# Altium schematic sheet 09.SchDoc
size 594 x 420 mm
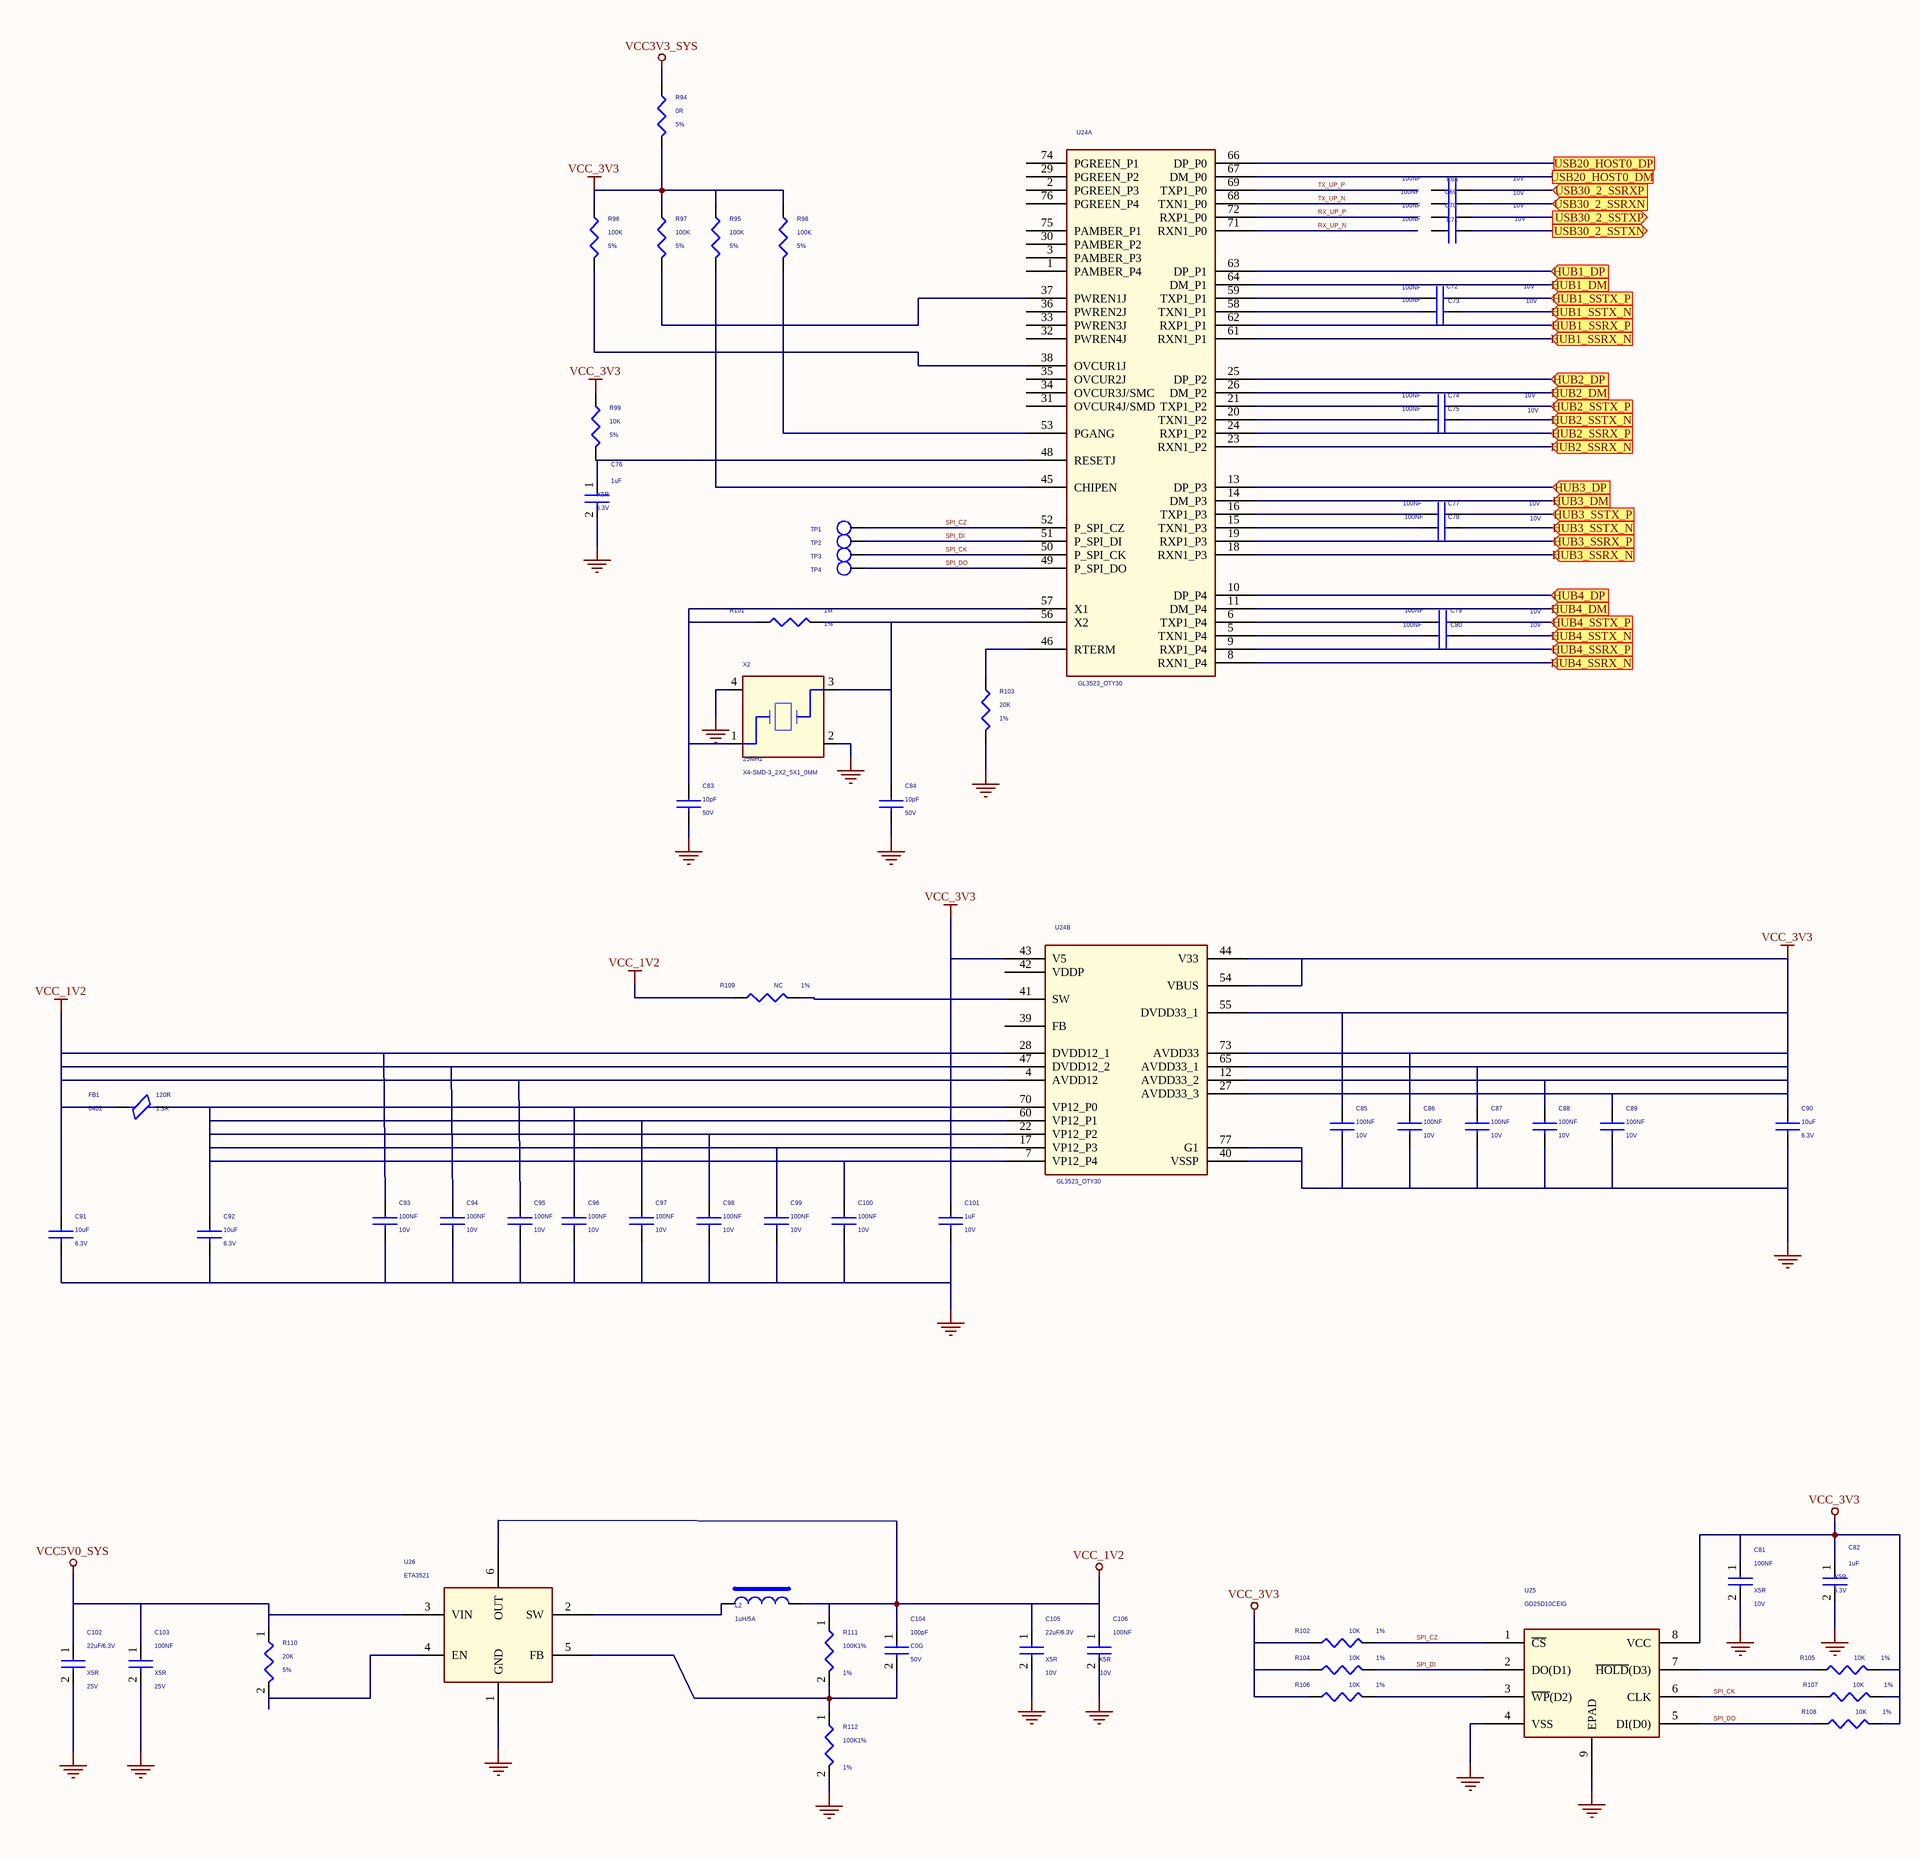
[diagram p0: 09.SchDoc]

## Parts
C68  100NF  Rating: 10V  [C0201]
C69  100NF  Rating: 10V  [C0201]
C70  100NF  Rating: 10V  [C0201]
C71  100NF  Rating: 10V  [C0201]
C72  100NF  Rating: 10V  [C0201]
C73  100NF  Rating: 10V  [C0201]
C74  100NF  Rating: 10V  [C0201]
C75  100NF  Rating: 10V  [C0201]
C76  1uF  Voltage: 6.3V  Dielectric: X5R  [C0201]
C77  100NF  Rating: 10V  [C0201]
C78  100NF  Rating: 10V  [C0201]
C79  100NF  Rating: 10V  [C0201]
C80  100NF  Rating: 10V  [C0201]
C81  100NF  Voltage: 10V  Dielectric: X5R  [C0201]
C82  1uF  Voltage: 6.3V  Dielectric: X5R  [C0201]
C83  10pF  Rating: 50V  [C0201]
C84  10pF  Rating: 50V  [C0201]
C85  100NF  Rating: 10V  [C0201]
C86  100NF  Rating: 10V  [C0201]
C87  100NF  Rating: 10V  [C0201]
C88  100NF  Rating: 10V  [C0201]
C89  100NF  Rating: 10V  [C0201]
C90  10uF  Rating: 6.3V  [C0402]
C91  10uF  Rating: 6.3V  [C0402]
C92  10uF  Rating: 6.3V  [C0402]
C93  100NF  Rating: 10V  [C0201]
C94  100NF  Rating: 10V  [C0201]
C95  100NF  Rating: 10V  [C0201]
C96  100NF  Rating: 10V  [C0201]
C97  100NF  Rating: 10V  [C0201]
C98  100NF  Rating: 10V  [C0201]
C99  100NF  Rating: 10V  [C0201]
C100  100NF  Rating: 10V  [C0201]
C101  1uF  Rating: 10V  [C0201]
C102  22uF/6.3V  Voltage: 25V  Dielectric: X5R  [C0805]
C103  100NF  Voltage: 25V  Dielectric: X5R  [C0402]
C104  100pF  Voltage: 50V  Dielectric: C0G  [C0402]
C105  22uF/6.3V  Voltage: 10V  Dielectric: X5R  [C0805]
C106  100NF  Voltage: 10V  Dielectric: X5R  [C0402]
FB1  120R  Rating: 1.3A  Package Size: 0402  [L0402]
L2  1uH/5A  [IND-303015]
R94  0R  Rating: 5%  [R0603]
R95  100K  Rating: 5%  [R0201]
R96  100K  Rating: 5%  [R0201]
R97  100K  Rating: 5%  [R0201]
R98  100K  Rating: 5%  [R0201]
R99  10K  Rating: 5%  [R0201]
R101  1M  Rating: 1%  [R0201]
R102  10K  Rating: 1%  [R0201]
R103  20K  Rating: 1%  [R0201]
R104  10K  Rating: 1%  [R0201]
R105  10K  Rating: 1%  [R0201]
R106  10K  Rating: 1%  [R0201]
R107  10K  Rating: 1%  [R0201]
R108  10K  Rating: 1%  [R0201]
R109  NC  Rating: 1%  [R0201]
R110  20K  Tolerance: 5%  [R0402]
R111  100K1%  Tolerance: 1%  [R0402]
R112  100K1%  Tolerance: 1%  [R0402]
TP1  TP  [tp1-8040]  (value not drawn)
TP2  TP  [tp1-8040]  (value not drawn)
TP3  TP  [tp1-8040]  (value not drawn)
TP4  TP  [tp1-8040]  (value not drawn)
U24  GL3523_OTY30  [GL3523_OTY30]  (parts A,B of 2)
U25  GD25D10CEIG  [USON8]
U26  ETA3521  [SOT563]
X2  25MHz  [X4-SMD-3_2X2_5X1_0MM]

## Ports
HUB1_DM (in), HUB1_DP (in), HUB1_SSRX_N (in), HUB1_SSRX_P (in), HUB1_SSTX_N (in), HUB1_SSTX_P (in), HUB2_DM (in), HUB2_DP (in), HUB2_SSRX_N (in), HUB2_SSRX_P (in), HUB2_SSTX_N (in), HUB2_SSTX_P (in), HUB3_DM (in), HUB3_DP (in), HUB3_SSRX_N (in), HUB3_SSRX_P (in), HUB3_SSTX_N (in), HUB3_SSTX_P (in), HUB4_DM (in), HUB4_DP (in), HUB4_SSRX_N (in), HUB4_SSRX_P (in), HUB4_SSTX_N (in), HUB4_SSTX_P (in), USB20_HOST0_DM, USB20_HOST0_DP, USB30_2_SSRXN (in), USB30_2_SSRXP (in), USB30_2_SSTXN (out), USB30_2_SSTXP (out)

## Nets
GND: C76.2 C81.2 C82.2 C83.2 C84.2 C85.2 C86.2 C87.2 C88.2 C89.2 C90.2 C91.2 C92.2 C93.2 C94.2 C95.2 C96.2 C97.2 C98.2 C99.2 C100.2 C101.2 C102.2 C103.2 C105.2 C106.2 R103.2 R112.2 U24.40(VSSP) U24.77(G1) U25.4(VSS) U25.9(EPAD) U26.1(GND) X2.2 X2.4
VCC3V3_SYS: R94.1
VCC5V0_SYS: C102.1 C103.1 R110.1 U26.3(VIN)
VCC_1V2: C91.1 C93.1 C94.1 C95.1 C104.1 C105.1 C106.1 FB1.1 L2.2 R109.1 R111.1 U24.4(AVDD12) U24.28(DVDD12_1) U24.47(DVDD12_2) U26.6(OUT)
VCC_3V3: C81.1 C82.1 C85.1 C86.1 C87.1 C88.1 C89.1 C90.1 C101.1 R94.2 R95.1 R96.1 R97.1 R98.1 R99.1 R102.1 R104.1 R105.2 R106.1 R107.2 R108.2 U24.12(AVDD33_2) U24.27(AVDD33_3) U24.43(V5) U24.44(V33) U24.54(VBUS) U24.55(DVDD33_1) U24.65(AVDD33_1) U24.73(AVDD33) U25.8(VCC)
HUB1_DM: U24.64(DM_P1) ; port HUB1_DM
HUB1_DP: U24.63(DP_P1) ; port HUB1_DP
HUB1_SSRX_N: U24.61(RXN1_P1) ; port HUB1_SSRX_N
HUB1_SSRX_P: U24.62(RXP1_P1) ; port HUB1_SSRX_P
HUB1_SSTX_N: C73.2 ; port HUB1_SSTX_N
HUB1_SSTX_P: C72.2 ; port HUB1_SSTX_P
HUB2_DM: U24.26(DM_P2) ; port HUB2_DM
HUB2_DP: U24.25(DP_P2) ; port HUB2_DP
HUB2_SSRX_N: U24.23(RXN1_P2) ; port HUB2_SSRX_N
HUB2_SSRX_P: U24.24(RXP1_P2) ; port HUB2_SSRX_P
HUB2_SSTX_N: C75.2 ; port HUB2_SSTX_N
HUB2_SSTX_P: C74.2 ; port HUB2_SSTX_P
HUB3_DM: U24.14(DM_P3) ; port HUB3_DM
HUB3_DP: U24.13(DP_P3) ; port HUB3_DP
HUB3_SSRX_N: U24.18(RXN1_P3) ; port HUB3_SSRX_N
HUB3_SSRX_P: U24.19(RXP1_P3) ; port HUB3_SSRX_P
HUB3_SSTX_N: C78.2 ; port HUB3_SSTX_N
HUB3_SSTX_P: C77.2 ; port HUB3_SSTX_P
HUB4_DM: U24.11(DM_P4) ; port HUB4_DM
HUB4_DP: U24.10(DP_P4) ; port HUB4_DP
HUB4_SSRX_N: U24.8(RXN1_P4) ; port HUB4_SSRX_N
HUB4_SSRX_P: U24.9(RXP1_P4) ; port HUB4_SSRX_P
HUB4_SSTX_N: C80.2 ; port HUB4_SSTX_N
HUB4_SSTX_P: C79.2 ; port HUB4_SSTX_P
RX_UP_N: U24.71(RXN1_P0)
RX_UP_P: U24.72(RXP1_P0)
SPI_CK: R107.1 TP3.1(TP) U24.50(P_SPI_CK) U25.6(CLK)
SPI_CZ: R102.2 TP1.1(TP) U24.52(P_SPI_CZ) U25.1(~{CS})
SPI_DI: R104.2 TP2.1(TP) U24.51(P_SPI_DI) U25.2(DO(D1))
SPI_DO: R108.1 TP4.1(TP) U24.49(P_SPI_DO) U25.5(DI(D0))
TX_UP_N: U24.68(TXN1_P0)
TX_UP_P: U24.69(TXP1_P0)
USB20_HOST0_DM: U24.67(DM_P0) ; port USB20_HOST0_DM
USB20_HOST0_DP: U24.66(DP_P0) ; port USB20_HOST0_DP
USB30_2_SSRXN: C69.1 ; port USB30_2_SSRXN
USB30_2_SSRXP: C68.1 ; port USB30_2_SSRXP
USB30_2_SSTXN: C71.1 ; port USB30_2_SSTXN
USB30_2_SSTXP: C70.1 ; port USB30_2_SSTXP
NetC72_1: C72.1 U24.59(TXP1_P1)
NetC73_1: C73.1 U24.58(TXN1_P1)
NetC74_1: C74.1 U24.21(TXP1_P2)
NetC75_1: C75.1 U24.20(TXN1_P2)
NetC76_1: C76.1 R99.2 U24.48(RESETJ)
NetC77_1: C77.1 U24.16(TXP1_P3)
NetC78_1: C78.1 U24.15(TXN1_P3)
NetC79_1: C79.1 U24.6(TXP1_P4)
NetC80_1: C80.1 U24.5(TXN1_P4)
NetC83_1: C83.1 R101.1 U24.57(X1) X2.1
NetC84_1: C84.1 R101.2 U24.56(X2) X2.3
NetC92_1: C92.1 C96.1 C97.1 C98.1 C99.1 C100.1 FB1.2 U24.7(VP12_P4) U24.17(VP12_P3) U24.22(VP12_P2) U24.60(VP12_P1) U24.70(VP12_P0)
NetC104_2: C104.2 R111.2 R112.1 U26.5(FB)
NetL2_1: L2.1 U26.2(SW)
NetR95_2: R95.2 U24.45(CHIPEN)
NetR96_2: R96.2 U24.38(OVCUR1J)
NetR97_2: R97.2 U24.37(PWREN1J)
NetR98_2: R98.2 U24.53(PGANG)
NetR103_1: R103.1 U24.46(RTERM)
NetR105_1: R105.1 U25.7(~{HOLD}(D3))
NetR106_2: R106.2 U25.3(~{WP}(D2))
NetR109_2: R109.2 U24.41(SW)
NetR110_2: R110.2 U26.4(EN)

Not connected (* = marked no-connect by the designer): C68 2; C69 2; C70 2; C71 2; U24 1(PAMBER_P4) 2(PGREEN_P3) 3(PAMBER_P3) 29(PGREEN_P2) 30(PAMBER_P2) 31(OVCUR4J/SMD) 32(PWREN4J) 33(PWREN3J) 34(OVCUR3J/SMC) 35(OVCUR2J) 36(PWREN2J) 39(FB) 42(VDDP) 74(PGREEN_P1) 75(PAMBER_P1) 76(PGREEN_P4)

## Library data of the parts
C68 C72-C75 C77-C80 C88 C89 C99 C100 = CC: CAP, Ceramic, SMD, 100nF, 10%, 10V, 0201; Company Part Status: ODYSSEY-i.MX8M; Manufacturer: YAGEO; Manufacturer PN: CC0201KRX5R6BB104; PN: 302010271; Temperature Coefficient: X5R; CLASS: DISCRETE; Package Size: 0201; Dielectric Type: Ceramic; Tolerance: 10%
C69-C71 C85-C87 C93-C98 = CC: CAP, Ceramic, SMD, 100nF, 10%, 10V, 0201; Manufacturer PN: CC0201KRX5R6BB104; Manufacturer: YAGEO; Company Part Status: ODYSSEY-i.MX8M; CLASS: DISCRETE; Temperature Coefficient: X5R; PN: 302010271; Tolerance: 10%; Dielectric Type: Ceramic; Package Size: 0201
C76 = CAP NP: cap,1.00uF,+/-10%,6.3V,X5R,C0402; Manufacturer: TDK; Number: 37; RK PN: C1005X5R0J105K050BB; Priority: A; Tolerance: 10%; Option: @SPI Flash; Part Type: C0402; Manufacturer PN: C1005X5R0J105K050BB; C_Voltage: 6.3V; Created by: JJJ
C81 = CAP NP: cap,100.00nF,+/-10%,10V,X5R,C0402; Manufacturer PN: C1005X5R1A104K050BA; Manufacturer: TDK; Tolerance: 10%; Priority: A; Option: @SPI Flash; Created by: JJJ; Part Type: C0402; RK PN: C1005X5R1A104K050BA
C82 = CAP NP: cap,1.00uF,+/-10%,6.3V,X5R,C0402; Manufacturer PN: C1005X5R0J105K050BB; Manufacturer: TDK; Option: @SPI Flash; Tolerance: 10%; Priority: A; Number: 37; Created by: JJJ; C_Voltage: 6.3V; Part Type: C0402; RK PN: C1005X5R0J105K050BB
C83 C84 = CC: CAP, Ceramic, SMD, 22pF, 5%, 50V, 0402; Manufacturer PN: CC0402JRNPO9BN220; Manufacturer: YAGEO; Company Part Status: BeagleBone Carrier Board; CLASS: DISCRETE; Temperature Coefficient: NPO; PN: 302010018; Tolerance: 5%; Dielectric Type: Ceramic; Package Size: 0402
C90-C92 = CC: CAP, Ceramic, SMD, 10uF, 20%, 6.3V, 0402; Company Part Status: ST; Manufacturer: YAGEO; Manufacturer PN: CC0402MRX5R5BB106; PN: 302010053; CLASS: DISCRETE; Package Size: 0402; Dielectric Type: Ceramic; Tolerance: 20%
C101 = CC: CAP, Ceramic, SMD, 1uF, 10%, 10V, 0402; Manufacturer PN: CC0402KRX5R6BB105; Manufacturer: YAGEO; Company Part Status: BeagleBone Carrier Board; CLASS: DISCRETE; Temperature Coefficient: X5R; PN: 302010040; Tolerance: 10%; Dielectric Type: Ceramic; Package Size: 0402
C102 = CAP NP: cap,10.00uF,+/-10%,25V,X5R,C0805; Manufacturer: TDK; RK PN: C2012X5R1E106K085AC; Priority: A; Tolerance: 10%; Part Type: C0805; Manufacturer PN: C2012X5R1E106K085AC; Created by: JJJ
C103 = CAP NP: cap,100.00nF,+/-10%,25V,X5R,C0402; Manufacturer PN: C1005X5R1E104K050BC; Manufacturer: TDK; Tolerance: 10%; Priority: A; Created by: JJJ; Part Type: C0402; RK PN: C1005X5R1E104K050BC
C104 = CAP NP: cap,100.00pF,+/-5%,50V,C0G,C0402; Manufacturer: TDK; RK PN: C1005C0G1H101J050BA; Priority: A; Tolerance: 5%; Part Type: C0402; Manufacturer PN: C1005C0G1H101J050BA; Created by: JJJ
C105 = CAP NP: cap,10.00uF,+/-10%,10V,X5R,C0805; Manufacturer: TDK; RK PN: C2012X5R1A106K125AB; Priority: A; Tolerance: 10%; Part Type: C0805; Manufacturer PN: C2012X5R1A106K125AB; Created by: JJJ
C106 = CAP NP: cap,100.00nF,+/-10%,10V,X5R,C0402; Manufacturer PN: C1005X5R1A104K050BA; Manufacturer: TDK; Tolerance: 10%; Priority: A; Created by: JJJ; Part Type: C0402; RK PN: C1005X5R1A104K050BA
FB1 = FB: Ferrite Bead, 120R, , 1.3A, 0402; Manufacturer PN: BLM15PD121SN1D; Manufacturer: Murata; Company Part Status: BeagleBone Carrier Board; CLASS: DISCRETE; PN: 303030040
L2 = INDUCTORS OF FERRITE: Power Inductor,3.3uH,0.2,IND_404030; Manufacturer PN: SWPA4030S3R3MT; Manufacturer: sunlord; Isat: 3.3A; DC Resistor: 0.04ohm; Resonace frequency: 38M; Irms: 2.4A; Tolerance: 20%; Priority: A; Created by: YTL; Part Type: POWER_IND; RK PN: SWPA4030S3R3MT
R94-R97 = R: RES, Thick Film, 100K, 5%, 1/16W, SMD, 0402; Manufacturer PN: RC0402JR-07100KL; Manufacturer: YAGEO; Company Part Status: BeagleBone Carrier Board; CLASS: DISCRETE; PN: 301010033; Rated Power: 1/16W; Package Size: 0402
R98 R99 = R: RES, Thick Film, 100K, 5%, 1/16W, SMD, 0402; Company Part Status: BeagleBone Carrier Board; Manufacturer: YAGEO; Manufacturer PN: RC0402JR-07100KL; PN: 301010033; CLASS: DISCRETE; Package Size: 0402; Rated Power: 1/16W
R101 R105 R108 R109 = R: RES, Thick Film, 1M, 1%, 1/16W, SMD, 0402; Company Part Status: BeagleBone Carrier Board; Manufacturer: YAGEO; Manufacturer PN: RC0402FR-071ML; PN: 301010043; CLASS: DISCRETE; Rated Power: 1/16W
  R101 R105 R108: Package Size: 0402
  R109: Package Size: 0603
R102 R104 R106 R107 = R: RES, Thick Film, 1M, 1%, 1/16W, SMD, 0402; Manufacturer PN: RC0402FR-071ML; Manufacturer: YAGEO; Company Part Status: BeagleBone Carrier Board; CLASS: DISCRETE; PN: 301010043; Rated Power: 1/16W; Package Size: 0402
R103 = R: RES, Thick Film, 680R, 1%, 1/16W, SMD, 0402; Company Part Status: BeagleBone Carrier Board; Manufacturer: YAGEO; Manufacturer PN: RC0402FR-07680RL; PN: 301010829; CLASS: DISCRETE; Package Size: 0402; Rated Power: 1/16W
R110 = RESISTOR: 通用厚膜电阻,100K,+/-5%,R0402,1/16W.; Manufacturer PN: RC0402JR-07100KL; Manufacturer: YAGEO; Wattage: 1/16W; Priority: A; Created by: YTL; Part Type: 通用厚膜电阻; RK PN: RC0402JR-07100KL
R111 = RESISTOR: 通用厚膜电阻,75K,+/-1%,R0402,1/16W.; Manufacturer: YAGEO; RK PN: RC0402FR-0775KL; Priority: A; Wattage: 1/16W; Part Type: 通用厚膜电阻; Manufacturer PN: RC0402FR-0775KL; Created by: YTL
R112 = RESISTOR: 通用厚膜电阻,10K,+/-1%,R0402,1/16W.; Manufacturer PN: RC0402FR-0710KL; Manufacturer: YAGEO; Wattage: 1/16W; Priority: A; Created by: YTL; Part Type: 通用厚膜电阻; RK PN: RC0402FR-0710KL
TP1-TP4 = Test Point: MISC, Test Point, Test Point, SMD, TP30C_SMD; Company Part Status: Grove Base Cape for PocketBeagle; ASSY: DNP; CLASS: DISCRETE; PN: TP30C_SMD; Package Size: TP30C_SMD
U24 = GL3523
U25 = SPI_FLASH_8PIN_T_0: 256M-bit Serial Flash;32M-byte;3.3V Uniform Sector;Dual and Quad Serial Flash;; Manufacturer PN: GD25Q256CYGR; Manufacturer: GigaDevice; Option: @SPI Flash; Priority: A; Created by: JJJ; Part Type: SPI_FLASH; RK PN: GD25Q256CYGR
X2 = XTAL_4P: Oscillator, SMD, 25MHz, 20 ppm, 18pF; Company Part Status: S5; Manufacturer: Interquip; Manufacturer PN: 5ZAA25000182TFA0Q3; PN: 306011049; Frequency Tolerance: 20 ppm; CLASS: DISCRETE; Package Size: X4-SMD-3_2X2_5X1_0MM